# Altium project 28陈雨笙Test.PrjPCB
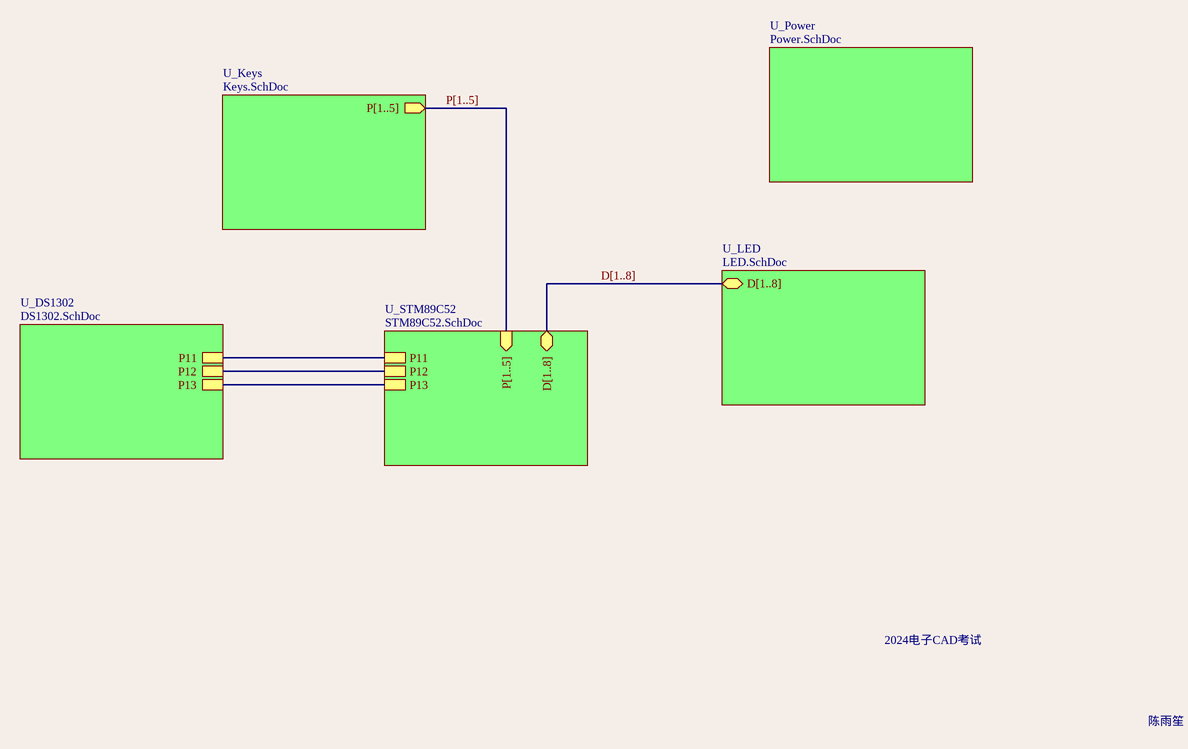
[diagram p0: Top.SchDoc]
6 sheets, 36 parts. Net scope: hierarchical (ports join the sheet entries above them; power ports are global).
Board file: 陈雨笙Test.PcbDoc
Sheets:
  Top.SchDoc
    U_Power = Power.SchDoc
    U_STM89C52 = STM89C52.SchDoc
    U_DS1302 = DS1302.SchDoc
    U_Keys = Keys.SchDoc
    U_LED = LED.SchDoc

## Sheet Top.SchDoc
size A4

### Sub-sheets
U_DS1302 = DS1302.SchDoc: P11, P12, P13
U_Keys = Keys.SchDoc: P[1..5] (out)
U_LED = LED.SchDoc: D[1..8] (bidir)
U_Power = Power.SchDoc: no entries
U_STM89C52 = STM89C52.SchDoc: D[1..8] (bidir), P11, P12, P13, P[1..5] (in)

### Nets
NetU1_5: sheet U_STM89C52/P13, sheet U_DS1302/P13
NetU1_6: sheet U_STM89C52/P12, sheet U_DS1302/P12
NetU1_7: sheet U_STM89C52/P11, sheet U_DS1302/P11

### Buses and harness runs
bus D[1..8] = sheet U_LED/D[1..8] = sheet U_STM89C52/D[1..8]
bus P[1..5] = sheet U_Keys/P[1..5] = sheet U_STM89C52/P[1..5]

### Notes on the sheet
- 2024电子CAD考试
- 陈雨笙

## Sheet Power.SchDoc
size A4
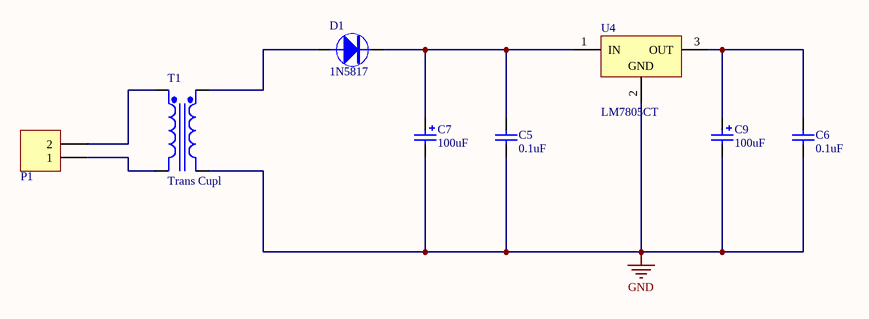
[diagram p1: Power.SchDoc]

### Parts
C5  value 0.1uF  [RAD-0.2]  (hidden comment: Cap)
C6  value 0.1uF  [RAD-0.2]  (hidden comment: Cap)
C7  value 100uF  [RB7.6-15]  (hidden comment: Cap Pol1)
C9  value 100uF  [RB7.6-15]  (hidden comment: Cap Pol1)
D1  1N5817  [DO-15]
P1  Header 2  [HDR1X2]  (value not drawn)
T1  Trans Cupl  [TRF_4]
U4  LM7805CT  [T03B]

### Nets
GND: C5.1 C6.1 C7.2 C9.2 T1.4(Sec-) U4.2(GND)
NetC5_2: C5.2 C7.1 D1.K U4.1(IN)
NetC6_2: C6.2 C9.1 U4.3(OUT)
NetD1_A: D1.A T1.3(Sec+)
NetP1_1: P1.1 T1.2(Pri-)
NetP1_2: P1.2 T1.1(Pri+)

### Library data of the parts
C5 C6 = Cap: Capacitor; Published: 8-Jun-2000; LatestRevisionDate: 17-Jul-2002; LatestRevisionNote: Re-released for DXP Platform.; PackageReference: RAD-0.3; Publisher: Altium Limited
C7 C9 = Cap Pol1: Polarized Capacitor (Radial); Published: 8-Jun-2000; LatestRevisionDate: 17-Jul-2002; LatestRevisionNote: Re-released for DXP Platform.; PackageReference: RB7.6-15; Publisher: Altium Limited
D1 = 1N5817: 普通二极管
P1 = Header 2: Header, 2-Pin; LatestRevisionDate: 17-Jul-2002; LatestRevisionNote: Re-released for DXP Platform.; Publisher: Altium Limited
T1 = Trans Cupl: Transformer (Coupled Inductor Model); Published: 8-Jun-2000; LatestRevisionDate: 17-Jul-2002; LatestRevisionNote: Re-released for DXP Platform.; PackageReference: TRF_4; Publisher: Altium Limited
U4 = LM7805CT: Series 3-Terminal Positive Regulator; Note: Tab is connected to GND; Published: 15-Apr-2002; DatasheetVersion: May-1999; PackageVersion: 1995; PackageReference: T03B; Publisher: Altium Limited; PackageDescription: TO, Thru-Hole, Vertical, Heatsink Mounted; 3 In-Line Leads; Pitch 2.54 mm; ComponentLink1Description: Manufacturer Link; ComponentLink1URL: http://www.national.com/; ComponentLink2Description: Datasheet; ComponentLink2URL: http://www.national.com/ds.cgi/LM/LM7512C.pdf; ComponentLink3Description: URL Link1; ComponentLink3URL: http://www.national.com/pf/LM/LM7805C.html

## Sheet STM89C52.SchDoc
size A4
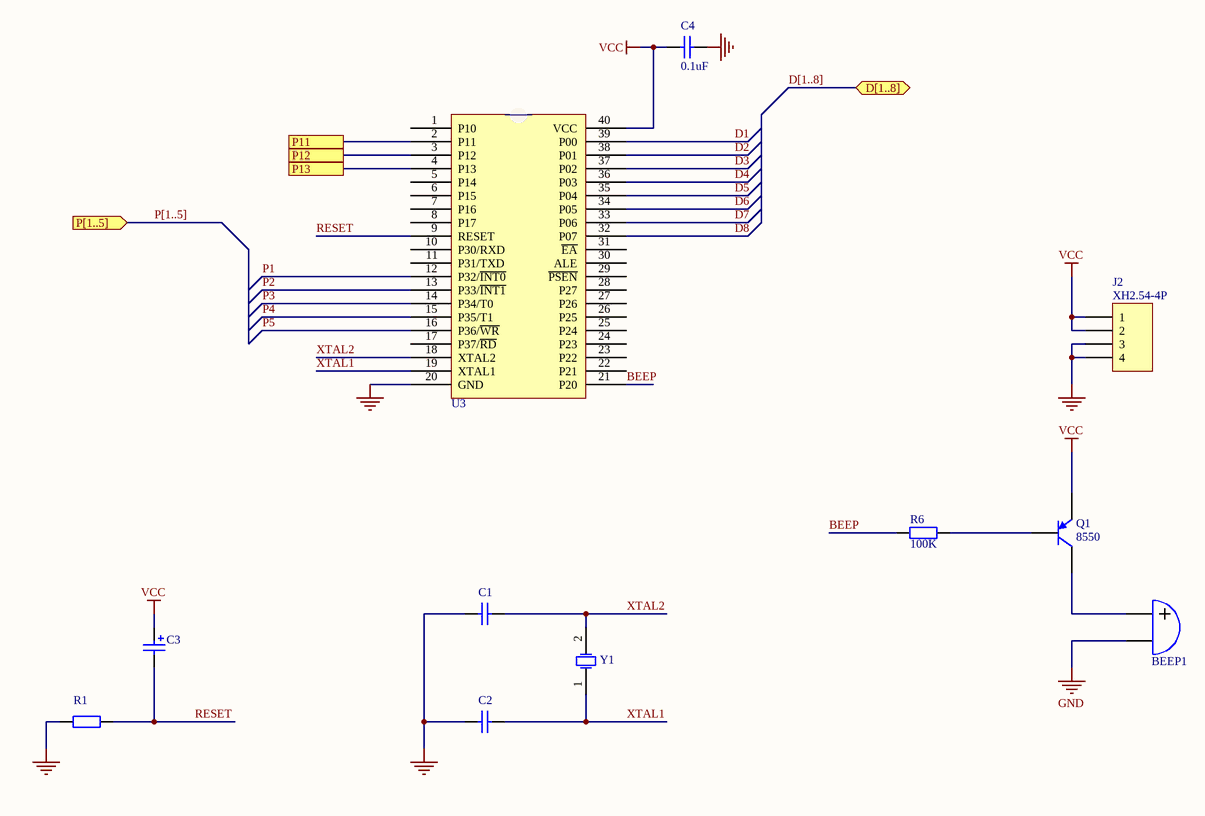
[diagram p2: STM89C52.SchDoc]

### Parts
BEEP1  BEEP  [BEEP]  (value not drawn)
C1  Cap  [RAD-0.2]  (value not drawn)
C2  Cap  [RAD-0.2]  (value not drawn)
C3  Cap Pol1  [RB7.6-15]  (value not drawn)
C4  value 0.1uF  [RAD-0.2]  (hidden comment: Cap)
J2  XH2.54-4P  [HDR1X4]
Q1  8550  [PNP]
R1  10K  [AXIAL-0.4]  (value not drawn)
R6  100K  [RES]
U3  STC89C52  [DIP40]  (value not drawn)
Y1  12MHZ  [XT12M]  (value not drawn)

### Ports
D[1..8] (bidir), P11, P12, P13, P[1..5] (in)

### Nets
GND: BEEP1.2 C1.2 C2.2 C4.1 J2.3 J2.4 R1.1 U3.20(GND)
VCC: C3.1 C4.2 J2.1 J2.2 Q1.1(E) U3.40(VCC)
BEEP: R6.1 U3.21(P20)
D1: U3.39(P00)
D2: U3.38(P01)
D3: U3.37(P02)
D4: U3.36(P03)
D5: U3.35(P04)
D6: U3.34(P05)
D7: U3.33(P06)
D8: U3.32(P07)
P1: U3.12(P32/~{INT0})
P2: U3.13(P33/~{INT1})
P3: U3.14(P34/T0)
P4: U3.15(P35/T1)
P5: U3.16(P36/~{WR})
RESET: C3.2 R1.2 U3.9(RESET)
XTAL1: C2.1 U3.19(XTAL1) Y1.1(OSC1)
XTAL2: C1.1 U3.18(XTAL2) Y1.2(OSC2)
NetBEEP1_1: BEEP1.1 Q1.3(C)
NetQ1_2: Q1.2(B) R6.2
NetU1_5: U3.4(P13) ; port P13
NetU1_6: U3.3(P12) ; port P12
NetU1_7: U3.2(P11) ; port P11

Not connected (* = marked no-connect by the designer): U3 1(P10) 5(P14) 6(P15) 7(P16) 8(P17) 10(P30/RXD) 11(P31/TXD) 17(P37/~{RD}) 22(P21) 23(P22) 24(P23) 25(P24) 26(P25) 27(P26) 28(P27) 29(~{PSEN}) 30(ALE) 31(~{EA})

### Buses and harness runs
bus D[1..8] = port D[1..8]
bus P[1..5] = port P[1..5]

### Library data of the parts
C1 C2 = Cap: Capacitor; value: 0.1uF; Published: 8-Jun-2000; LatestRevisionDate: 17-Jul-2002; LatestRevisionNote: Re-released for DXP Platform.; PackageReference: RAD-0.3; Publisher: Altium Limited
C3 = Cap Pol1: Polarized Capacitor (Radial); Value: 100uF; Published: 8-Jun-2000; LatestRevisionDate: 17-Jul-2002; LatestRevisionNote: Re-released for DXP Platform.; PackageReference: RB7.6-15; Publisher: Altium Limited
C4 = Cap: Capacitor; Published: 8-Jun-2000; LatestRevisionDate: 17-Jul-2002; LatestRevisionNote: Re-released for DXP Platform.; PackageReference: RAD-0.3; Publisher: Altium Limited
J2 = Header 4: Header, 4-Pin; LatestRevisionDate: 17-Jul-2002; LatestRevisionNote: Re-released for DXP Platform.; Publisher: Altium Limited
Q1 = PNP
R1 = Res2: Resistor; Published: 8-Jun-2000; LatestRevisionDate: 17-Jul-2002; LatestRevisionNote: Re-released for DXP Platform.; PackageReference: AXIAL-0.4; Publisher: Altium Limited; PackageDescription: Axial Device, Thru-Hole; 2 Leads; 0.4 in Pin Spacing; Value: 10K
R6 = Res
Y1 = XTAL: Crystal Oscillator; Published: 8-Jun-2000; LatestRevisionDate: 17-Jul-2002; LatestRevisionNote: Re-released for DXP Platform.; PackageReference: R38; Publisher: Altium Limited; PackageDescription: Crystal, Thru-Hole; 2 Leads; Body 3.1 x 8.2 mm (Dia.xH)

## Sheet DS1302.SchDoc
size A4
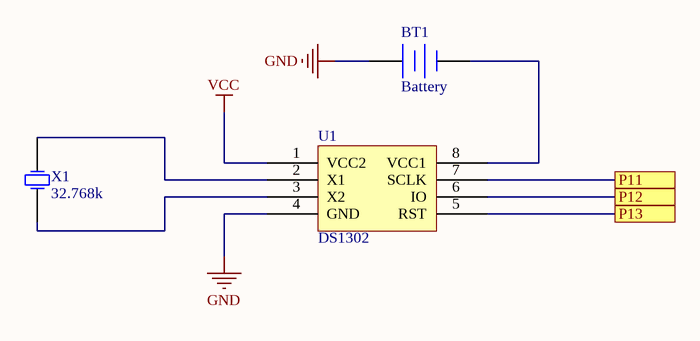
[diagram p3: DS1302.SchDoc]

### Parts
BT1  Battery  [BT]
U1  DS1302  [DIP8]
X1  32.768k  [XTAL2]

### Ports
P11, P12, P13

### Nets
GND: BT1.1(+) U1.4(GND)
VCC: U1.1(VCC2)
NetBT1_2: BT1.2(-) U1.8(VCC1)
NetU1_2: U1.2(X1) X1.2(OSC2)
NetU1_3: U1.3(X2) X1.1(OSC1)
NetU1_5: U1.5(RST) ; port P13
NetU1_6: U1.6(IO) ; port P12
NetU1_7: U1.7(SCLK) ; port P11

### Library data of the parts
X1 = XTAL_2

## Sheet Keys.SchDoc
size A4
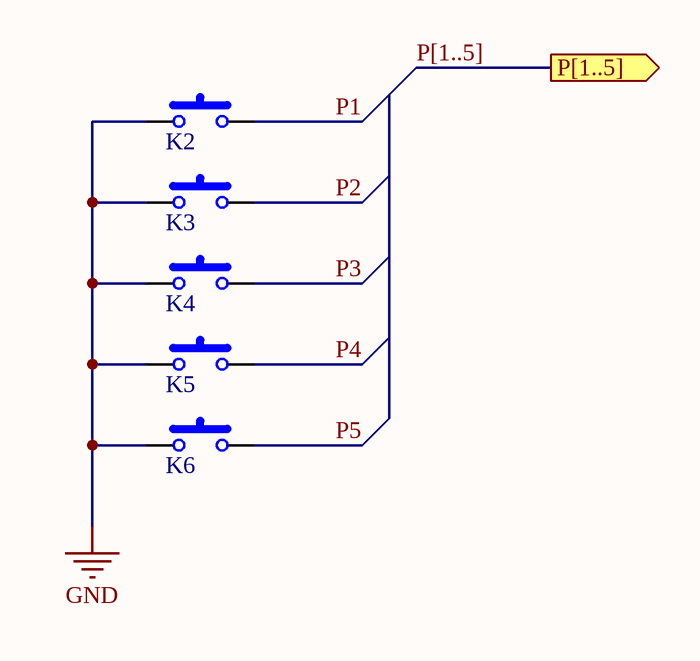
[diagram p4: Keys.SchDoc]

### Parts
K2  KEY  [TACK6]  (value not drawn)
K3  KEY  [TACK6]  (value not drawn)
K4  KEY  [TACK6]  (value not drawn)
K5  KEY  [TACK6]  (value not drawn)
K6  KEY  [TACK6]  (value not drawn)

### Ports
P[1..5] (out)

### Nets
GND: K2.1 K3.1 K4.1 K5.1 K6.1
P1: K2.2
P2: K3.2
P3: K4.2
P4: K5.2
P5: K6.2

### Buses and harness runs
bus P[1..5] = port P[1..5]

### Library data of the parts
K2-K6 = KEY: Switch; Published: 24-Mar-1999; LatestRevisionDate: 17-Jul-2002; LatestRevisionNote: Re-released for DXP Platform.; PackageReference: SPST-2; Publisher: Altium Limited

## Sheet LED.SchDoc
size A4
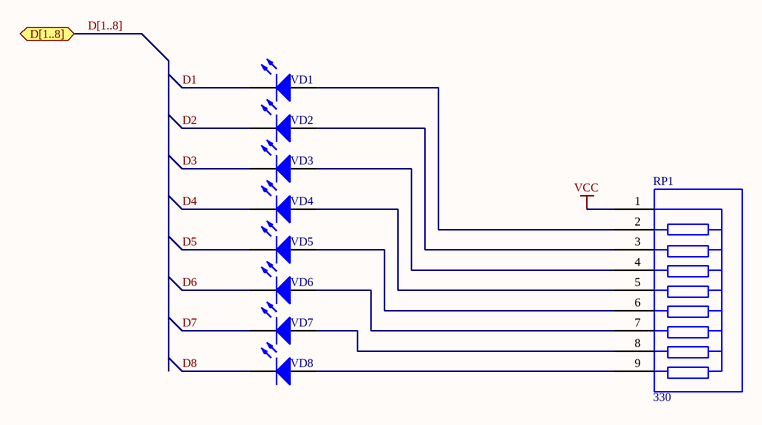
[diagram p5: LED.SchDoc]

### Parts
RP1  330  [SIP9]
VD1  BT101  [LED-5]  (value not drawn)
VD2  BT101  [LED-5]  (value not drawn)
VD3  BT101  [LED-5]  (value not drawn)
VD4  BT101  [LED-5]  (value not drawn)
VD5  BT101  [LED-5]  (value not drawn)
VD6  BT101  [LED-5]  (value not drawn)
VD7  BT101  [LED-5]  (value not drawn)
VD8  BT101  [LED-5]  (value not drawn)

### Ports
D[1..8] (bidir)

### Nets
VCC: RP1.1
D1: VD1.2(K)
D2: VD2.2(K)
D3: VD3.2(K)
D4: VD4.2(K)
D5: VD5.2(K)
D6: VD6.2(K)
D7: VD7.2(K)
D8: VD8.2(K)
NetRP1_2: RP1.2 VD1.1(A)
NetRP1_3: RP1.3 VD2.1(A)
NetRP1_4: RP1.4 VD3.1(A)
NetRP1_5: RP1.5 VD4.1(A)
NetRP1_6: RP1.6 VD5.1(A)
NetRP1_7: RP1.7 VD6.1(A)
NetRP1_8: RP1.8 VD7.1(A)
NetRP1_9: RP1.9 VD8.1(A)

### Buses and harness runs
bus D[1..8] = port D[1..8]

### Library data of the parts
RP1 = SIP-A09: Value: 330
VD1-VD8 = LED0: Typical INFRARED GaAs LED; Published: 8-Jun-2000; LatestRevisionDate: 08-Jul-2005; LatestRevisionNote: Mech Layer 1 removed.; PackageReference: LED-0; Publisher: Altium Limited; PackageDescription: LED; 2 Leads

## Nets that join several sheets
GND: Power (6 pins), STM89C52 (8 pins), DS1302 (BT1.1 U1.4), Keys (5 pins)
VCC: STM89C52 (6 pins), DS1302 (U1.1), LED (RP1.1)
D1: STM89C52 (U3.39), LED (VD1.2)
D2: STM89C52 (U3.38), LED (VD2.2)
D3: STM89C52 (U3.37), LED (VD3.2)
D4: STM89C52 (U3.36), LED (VD4.2)
D5: STM89C52 (U3.35), LED (VD5.2)
D6: STM89C52 (U3.34), LED (VD6.2)
D7: STM89C52 (U3.33), LED (VD7.2)
D8: STM89C52 (U3.32), LED (VD8.2)
NetU1_5: STM89C52 (U3.4), DS1302 (U1.5)
NetU1_6: STM89C52 (U3.3), DS1302 (U1.6)
NetU1_7: STM89C52 (U3.2), DS1302 (U1.7)
P1: STM89C52 (U3.12), Keys (K2.2)
P2: STM89C52 (U3.13), Keys (K3.2)
P3: STM89C52 (U3.14), Keys (K4.2)
P4: STM89C52 (U3.15), Keys (K5.2)
P5: STM89C52 (U3.16), Keys (K6.2)